# EAGLE schematic PCB version 1 (EAGLE 9.6.2)
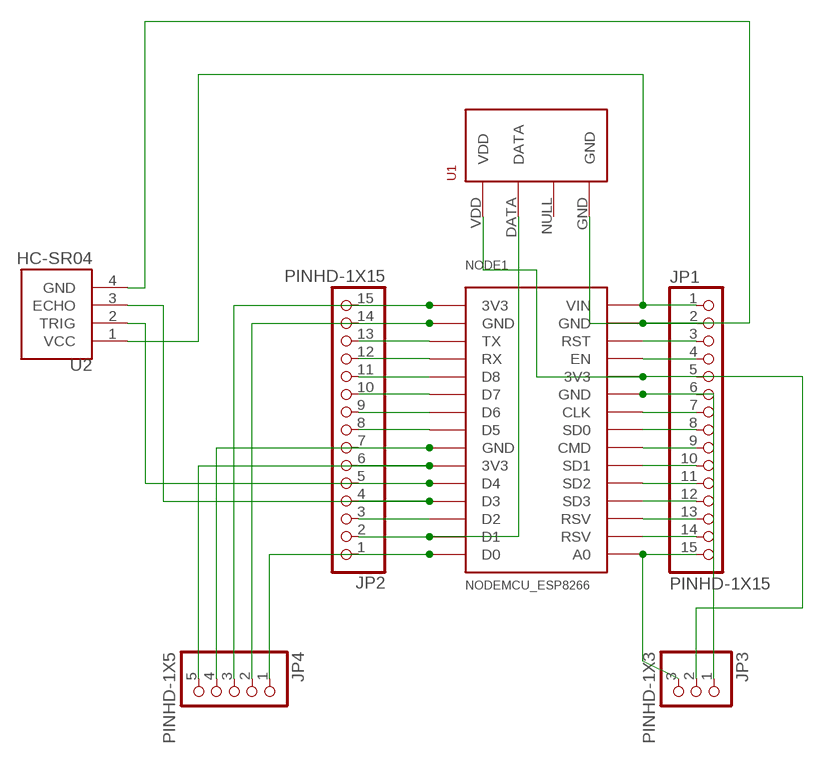
[diagram p0: schematic, sheet 1]

## Parts
JP1  PINHD-1X15  [1X15]
JP2  PINHD-1X15  [1X15]
JP3  PINHD-1X3  [1X03]
JP4  PINHD-1X5  [1X05]
NODE1  NODEMCU_ESP8266  [NODEMCU_ESP8266]
U1  RHT03_DHT-22_AM2302  [RHT03_DHT-22]
U2  HC-SR04  [XCVR_HC-SR04]

## Nets
N$1: JP2.15 JP4.3 NODE1.3V3@1(3V3)
N$2: JP2.14 JP4.2 NODE1.GND@1(GND)
N$3: JP2.13 NODE1.TX
N$4: JP2.6 JP4.5 NODE1.3V3@2(3V3)
N$5: JP2.12 NODE1.RX
N$6: JP2.11 NODE1.D8
N$7: JP2.10 NODE1.D7
N$8: JP2.9 NODE1.D6
N$9: JP2.8 NODE1.D5
N$10: JP2.7 JP4.4 NODE1.GND@2(GND)
N$12: JP2.5 NODE1.D4 U2.2(TRIG)
N$13: JP2.4 NODE1.D3 U2.3(ECHO)
N$14: JP2.3 NODE1.D2
N$15: JP2.2 NODE1.D1 U1.DATA
N$16: JP1.15 JP3.3 NODE1.A0
N$17: JP1.14 NODE1.RSV1(RSV)
N$18: JP1.13 NODE1.RSV2(RSV)
N$19: JP1.12 NODE1.SD3
N$20: JP1.11 NODE1.SD2
N$21: JP1.10 NODE1.SD1
N$22: JP1.9 NODE1.CMD
N$23: JP1.8 NODE1.SDO(SD0)
N$24: JP1.7 NODE1.CLK
N$25: JP1.6 JP3.1 NODE1.GND@3(GND)
N$26: JP2.1 JP4.1 NODE1.D0
N$27: JP1.4 NODE1.EN
N$28: JP1.3 NODE1.RST
N$29: JP1.2 NODE1.GND@4(GND) U1.GND U2.4(GND)
N$30: JP1.1 NODE1.VIN U2.1(VCC)
N$32: JP1.5 JP3.2 NODE1.3V3@3(3V3) U1.VDD
Unconnected: U1.NULL

## Library data of the parts
JP1 JP2 = Connector:PINHD-1X15: PIN HEADER; CATEGORY: CONNECTOR; SUB-CATEGORY: PIN-HEADER
JP3 = Connector:PINHD-1X3: PIN HEADER; CATEGORY: CONNECTOR; SUB-CATEGORY: PIN-HEADER
JP4 = Connector:PINHD-1X5: PIN HEADER; CATEGORY: CONNECTOR; SUB-CATEGORY: PIN-HEADER
NODE1 = nodemcu_esp8266:NODEMCU_ESP8266: Node MCU V2 (ESP8266) Created by Harish
U1 = RHT03_DHT-22_AM2302:RHT03_DHT-22_AM2302: RHT03 / DHT-22 / AM2302 Packages and symbol for the RHT03 / DHT-22 relative humidity and temperature sensor. Note: The AM2302 is a wired version of the DHT-22 which typically requires less clearance and is thus provided as a separate package.; PROD_ID: SEN-10167
U2 = HC-SR04:HC-SR04: Ultrasonic Sensor Module Check availability <https://pricing.snapeda.com/parts/HC-SR04/SparkFun%20Electronics/view-part?ref=eda>; AVAILABILITY: Not in stock; DESCRIPTION: HC-SR04 Ultrasonic Sensor Qwiic Platform Evaluation Expansion Board; MF: SparkFun Electronics; MP: HC-SR04; PACKAGE: None; PRICE: None